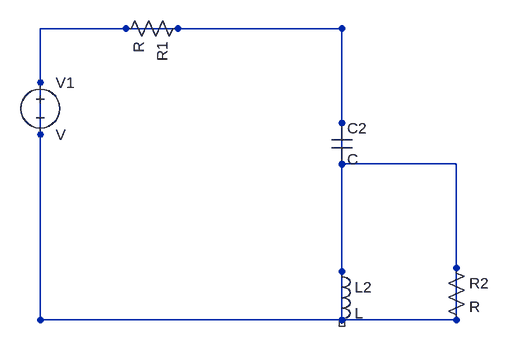
[diagram p0: schematic C111_D1_P3.jpg.asc]
C111_D1_P3.jpg.asc, the LTspice schematic file:
Version 4
SHEET 1 880 680
SYMBOL res 580 144 R90
SYMATTR InstName R1
SYMBOL res 976 512 R0
SYMATTR InstName R2
SYMBOL voltage 352 227 R0
SYMATTR InstName V1
SYMBOL cap 800 305 R0
SYMATTR InstName C1
SYMATTR InstName C2
SYMBOL ind 800 518 R0
SYMATTR InstName L1
SYMATTR InstName L2
WIRE 352 160 352 608
WIRE 352 160 816 160
WIRE 816 368 816 608
WIRE 352 608 816 608
WIRE 816 160 816 608
WIRE 816 608 992 608
WIRE 816 368 992 368
WIRE 816 160 816 368
WIRE 992 368 992 608
WIRE 352 608 992 608

The netlist it stands for:
* C111_D1_P3.jpg.asc
R1 N001 N001 R
R2 N001 N001 R
V1 N001 N001 V
C2 N001 N001 C
L2 N001 NC_01 L
.backanno
.end